# EAGLE board Flightcontroller (EAGLE 9.3.2)
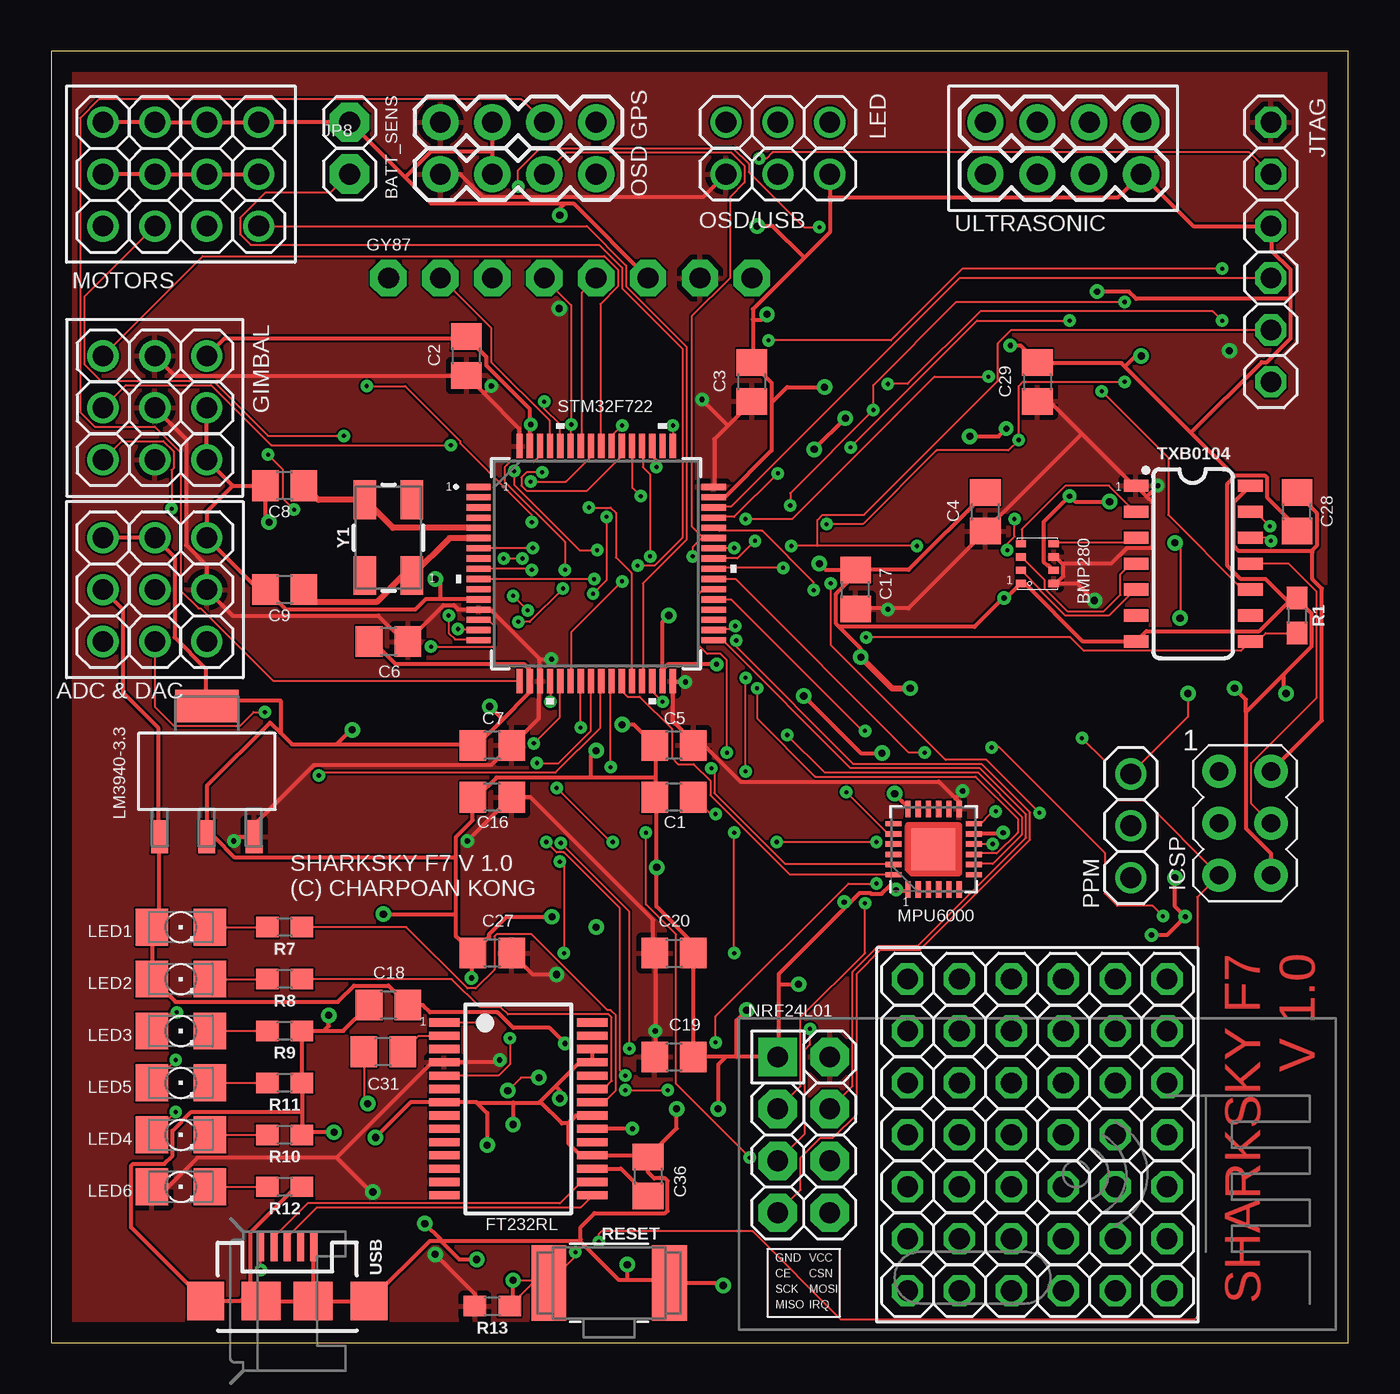
[diagram p10: board, top side]
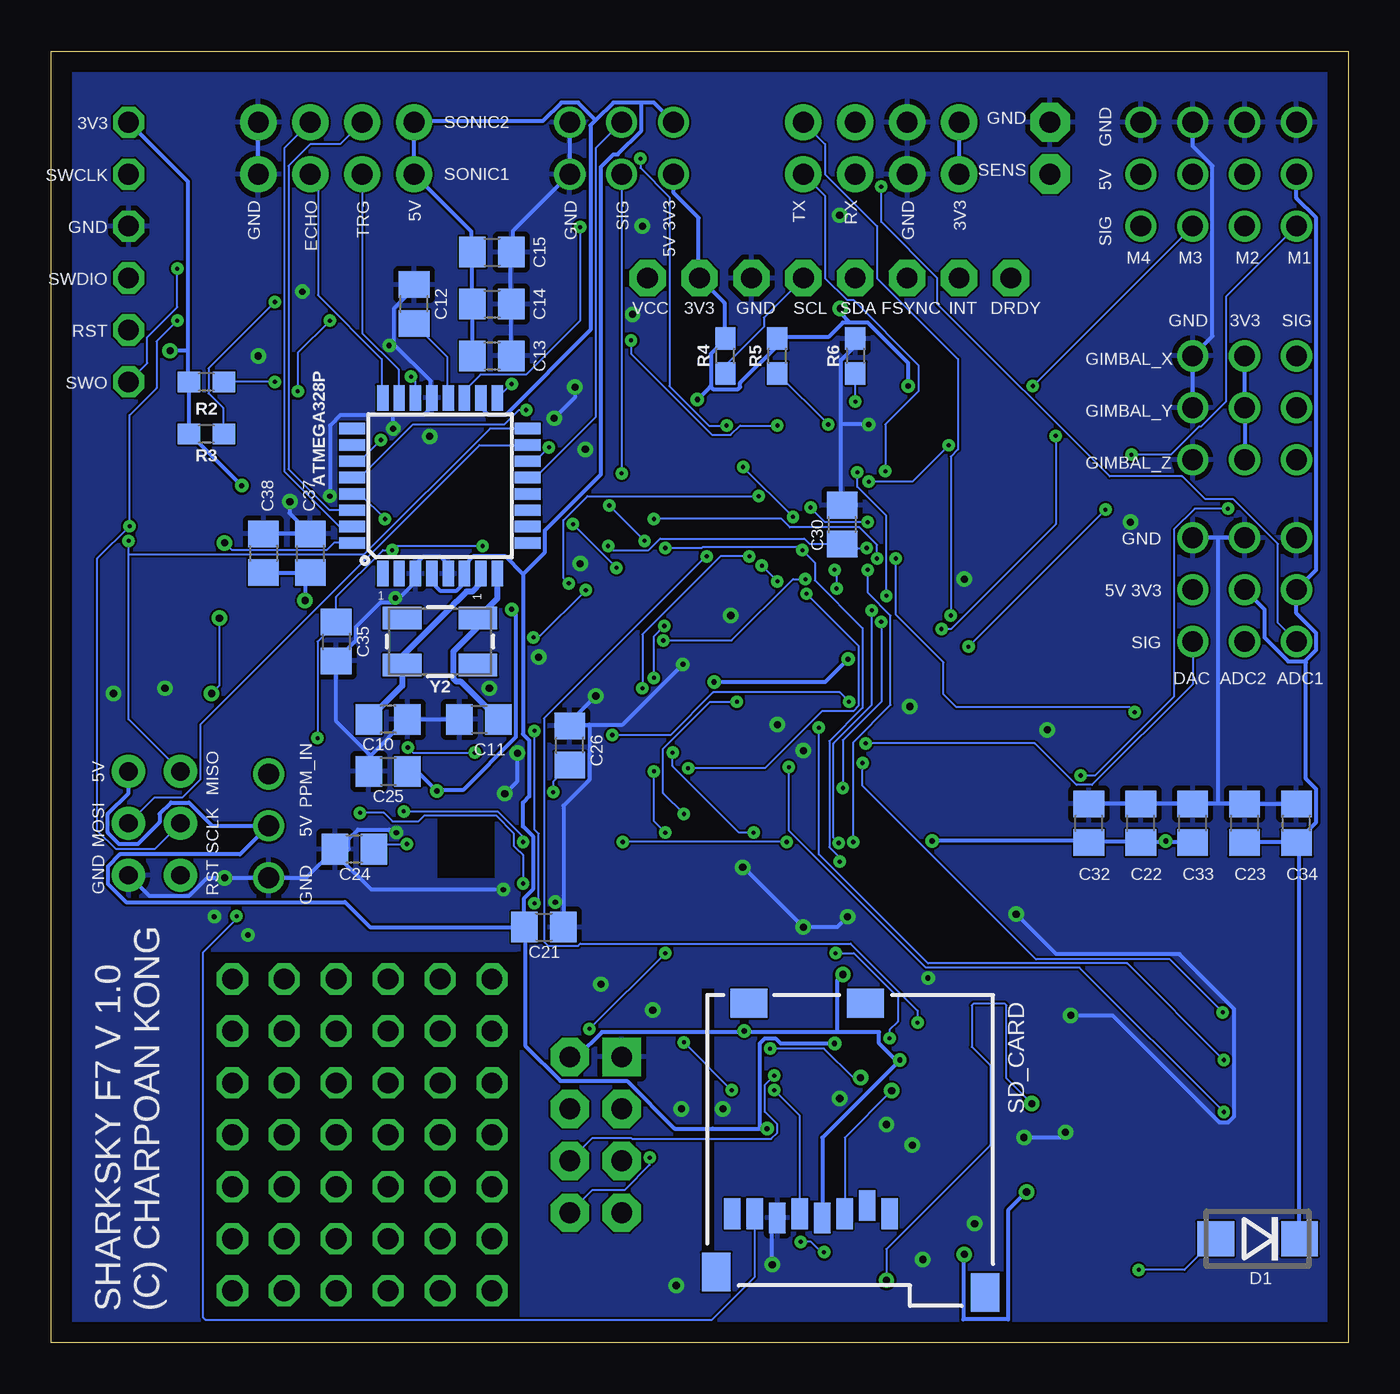
[diagram p11: board, bottom side, seen from below]

Size 63.48 x 63.17 mm. Coordinates in mm from the lower left corner, seen from the top.
Outline: 0,0 63.48,0 63.48,63.17 0,63.17 0,0
Copper layers (1*16): Top 0.035mm / dielectric 0.62mm / Bottom 0.035mm
Design rules "default *": minimum track width 4mil, minimum drill 8mil, track to track 4mil, track to pad 4mil, pad to pad 4mil, via to via 4mil, smd to smd 4mil, copper to edge 40mil, drill to drill 6mil, minimum pad ring 10mil, minimum via ring 8mil, stop-mask expansion 4mil, vias tented up to drill 14mil, thermal gap 10mil
Net classes: 0 default: width 0.102 mm, drill 0.102 mm, clearance 0.102 mm; 1 Supply: width 0.203 mm, drill 0.254 mm, clearance 0.102 mm
tKeepout: area 40.6,1.3 to 55.9,19.1; area 57.1,1.8 to 62,19.1; area 41.8,22.7 to 44.6,25.5
bKeepout: area 40.6,1.3 to 55.9,19.1; area 41.8,22.7 to 44.6,25.5
tRestrict: area 40.6,1.3 to 55.9,19.1; area 41.8,22.7 to 44.6,25.5
bRestrict: area 40.6,1.3 to 55.9,19.1; area 41.8,22.7 to 44.6,25.5

## Footprints (pad centres in the part's own frame; a part is rotated, then mirrored left to right if it is on the bottom)
1X03 = drill 1.016: 1 -2.54,0; 2 0,0; 3 2.54,0
TQFP32-08 = smd 1.27 x 0.559: 1 -4.293,2.8; 2 -4.293,2; 3 -4.293,1.2; 4 -4.293,0.4; 5 -4.293,-0.4; 6 -4.293,-1.2; 7 -4.293,-2; 8 -4.293,-2.8; 17 4.293,-2.8; 18 4.293,-2; 19 4.293,-1.2; 20 4.293,-0.4; 21 4.293,0.4; 22 4.293,1.2; 23 4.293,2; 24 4.293,2.8 | smd 0.559 x 1.27: 9 -2.8,-4.293; 10 -2,-4.293; 11 -1.2,-4.293; 12 -0.4,-4.293; 13 0.4,-4.293; 14 1.2,-4.293; 15 2,-4.293; 16 2.8,-4.293; 25 2.8,4.293; 26 2,4.293; 27 1.2,4.293; 28 0.4,4.293; 29 -0.4,4.293; 30 -1.2,4.293; 31 -2,4.293; 32 -2.8,4.293
1X01 = drill 1.016 pad 1.93 octagon: 1 0,0
BMP280 = smd 0.35 x 0.5: 1 0.975,-0.8; 2 0.325,-0.8; 3 -0.325,-0.8; 4 -0.975,-0.8; 5 -0.975,0.8; 6 -0.325,0.8; 7 0.325,0.8; 8 0.975,0.8
C0805 = smd 1.3 x 1.5: 1 -0.95,0; 2 0.95,0
DO214BA = smd 1.8 x 1.7: A 2.05,0; C -2.05,0
SSOP28 = smd 0.4 x 1.5: 1 -4.225,-3.625; 2 -3.575,-3.625; 3 -2.925,-3.625; 4 -2.275,-3.625; 5 -1.625,-3.625; 6 -0.975,-3.625; 7 -0.325,-3.625; 8 0.325,-3.625; 9 0.975,-3.625; 10 1.625,-3.625; 11 2.275,-3.625; 12 2.925,-3.625; 13 3.575,-3.625; 14 4.225,-3.625; 15 4.225,3.625; 16 3.575,3.625; 17 2.925,3.625; 18 2.275,3.625; 19 1.625,3.625; 20 0.975,3.625; 21 0.325,3.625; 22 -0.325,3.625; 23 -0.975,3.625; 24 -1.625,3.625; 25 -2.275,3.625; 26 -2.925,3.625; 27 -3.575,3.625; 28 -4.225,3.625
1X04-BIG = drill 1.016 pad 1.778: 1 0,0; 2 2.54,0; 3 5.08,0; 4 7.62,0
1X08-CLEANBIG = drill 1.016 pad 1.778 octagon: 1 -8.89,0; 2 -6.35,0; 3 -3.81,0; 4 -1.27,0; 5 1.27,0; 6 3.81,0; 7 6.35,0; 8 8.89,0
AVRISP = drill 0.9 pad 1.626: 1 -1.27,2.54; 2 1.27,2.54; 3 -1.27,0; 4 1.27,0; 5 -1.27,-2.54; 6 1.27,-2.54
1X06 = drill 1.016 octagon: 1 -6.35,0; 2 -3.81,0; 3 -1.27,0; 4 1.27,0; 5 3.81,0; 6 6.35,0
1206 = smd 1.6 x 1.803: A -1.422,0; C 1.422,0
SOT230P696X180-4N = smd 1.6 x 0.838: 1 -3.2,2.311; 2 -3.2,0; 3 -3.2,-2.311 | smd 1.6 x 3.099: 4 3.2,0
QFN50P400X400X95-25T265X275N = smd 0.26 x 0.79: 1 -1.25,-1.97; 2 -0.75,-1.97; 3 -0.25,-1.97; 4 0.25,-1.97; 5 0.75,-1.97; 6 1.25,-1.97; 13 1.25,1.97; 14 0.75,1.97; 15 0.25,1.97; 16 -0.25,1.97; 17 -0.75,1.97; 18 -1.25,1.97 | smd 0.79 x 0.26: 7 1.97,-1.25; 8 1.97,-0.75; 9 1.97,-0.25; 10 1.97,0.25; 11 1.97,0.75; 12 1.97,1.25; 19 -1.97,1.25; 20 -1.97,0.75; 21 -1.97,0.25; 22 -1.97,-0.25; 23 -1.97,-0.75; 24 -1.97,-1.25 | smd 2.15 x 2.05: 25 0,0
NRF24L01+ = drill 1.016 pad 1.88 octagon: CE -11.43,1.27; CSN -8.89,1.27; IRQ -8.89,-3.81; MISO -11.43,-3.81; MOSI -8.89,-1.27; SCK -11.43,-1.27; VCC -8.89,3.81 | drill 1.016 pad 1.88 square: GND -11.43,3.81
0603 = smd 1.1 x 1: 1 -0.85,0; 2 0.85,0
BTN_CK_KSS = smd 1.7 x 3.7: P$1 -2.95,0; P$2 2.95,0
3M_2908-05WB-MG = smd 0.8 x 1.5: 1 -1.94,3.1; 2 -0.84,2.7; 3 0.26,3.1; 4 1.36,3.3; 5 2.46,3.1; 6 3.56,3.3; 7 4.66,3.1; 8 5.76,3.1 | smd 1.4 x 1.9: P$1 6.55,5.95; P$2 -6.6,6.95 | smd 1.8 x 1.4: P$3 4.95,-7.2; P$4 -0.75,-7.2
LQFP64-10X10MM = smd 1.194 x 0.305: 1 -5.75,3.75; 2 -5.75,3.25; 3 -5.75,2.75; 4 -5.75,2.25; 5 -5.75,1.75; 6 -5.75,1.25; 7 -5.75,0.75; 8 -5.75,0.25; 9 -5.75,-0.25; 10 -5.75,-0.75; 11 -5.75,-1.25; 12 -5.75,-1.75; 13 -5.75,-2.25; 14 -5.75,-2.75; 15 -5.75,-3.25; 16 -5.75,-3.75; 33 5.75,-3.75; 34 5.75,-3.25; 35 5.75,-2.75; 36 5.75,-2.25; 37 5.75,-1.75; 38 5.75,-1.25; 39 5.75,-0.75; 40 5.75,-0.25; 41 5.75,0.25; 42 5.75,0.75; 43 5.75,1.25; 44 5.75,1.75; 45 5.75,2.25; 46 5.75,2.75; 47 5.75,3.25; 48 5.75,3.75 | smd 0.305 x 1.194: 17 -3.75,-5.75; 18 -3.25,-5.75; 19 -2.75,-5.75; 20 -2.25,-5.75; 21 -1.75,-5.75; 22 -1.25,-5.75; 23 -0.75,-5.75; 24 -0.25,-5.75; 25 0.25,-5.75; 26 0.75,-5.75; 27 1.25,-5.75; 28 1.75,-5.75; 29 2.25,-5.75; 30 2.75,-5.75; 31 3.25,-5.75; 32 3.75,-5.75; 49 3.75,5.75; 50 3.25,5.75; 51 2.75,5.75; 52 2.25,5.75; 53 1.75,5.75; 54 1.25,5.75; 55 0.75,5.75; 56 0.25,5.75; 57 -0.25,5.75; 58 -0.75,5.75; 59 -1.25,5.75; 60 -1.75,5.75; 61 -2.25,5.75; 62 -2.75,5.75; 63 -3.25,5.75; 64 -3.75,5.75
SO14 = smd 0.6 x 1.2: 1 -3.81,-2.8; 2 -2.54,-2.8; 3 -1.27,-2.8; 4 0,-2.8; 5 1.27,-2.8; 6 2.54,-2.8; 7 3.81,-2.8; 8 3.81,2.8; 9 2.54,2.8; 10 1.27,2.8; 11 0,2.8; 12 -1.27,2.8; 13 -2.54,2.8; 14 -3.81,2.8
USB-MICROB = smd 1.4 x 0.35: D+ -2.65,0; D- -2.65,-0.65; GND -2.65,1.3; ID -2.65,0.65; VBUS -2.65,-1.3 | smd 1.9 x 1.8: MT1 0,-4; MT2 0,4 | smd 1.9 x 1.9: P$1 0,-1.27; P$2 0,1.27
CRYSTAL-SMD-5X3.2-4PAD = smd 1.9 x 1.1: 1 -1.85,-1.15; 2 1.85,-1.15; 3 1.85,1.15; 4 -1.85,1.15

## Placement (x,y rotation side)
ADC1  [1X03]  2.54,36.83 90 top
ADC2  [1X03]  5.08,36.83 90 top
ATMEGA328P  ATMEGA328P_TQFP  [TQFP32-08]  44.45,41.91 90 bottom
BATT_SENS  [1X01]  14.61,59.69 0 top
BMP280  BMP280  [BMP280]  48.26,38.1 270 top
C1  4.7uF  [C0805]  30.48,26.67 180 top
C2  4.7uF  [C0805]  20.32,48.26 90 top
C3  100nF  [C0805]  34.29,46.99 90 top
C4  100nF  [C0805]  45.72,40.64 90 top
C5  100nF  [C0805]  30.48,29.21 180 top
C6  100nF  [C0805]  16.51,34.29 180 top
C7  100nF  [C0805]  21.59,29.21 180 top
C8  10pF  [C0805]  11.43,41.91 180 top
C9  10pF  [C0805]  11.43,36.83 180 top
C10  10pF  [C0805]  46.99,30.48 180 bottom
C11  10pF  [C0805]  42.55,30.48 0 bottom
C12  100nF  [C0805]  45.72,50.8 90 bottom
C13  4.7uF  [C0805]  41.91,48.26 0 bottom
C14  1uF  [C0805]  41.91,50.8 0 bottom
C15  1uF  [C0805]  41.91,53.34 0 bottom
C16  1uF  [C0805]  21.59,26.67 180 top
C17  1uF  [C0805]  39.37,36.83 90 top
C18  100nF  [C0805]  16.51,16.51 180 top
C19  100nF  [C0805]  30.48,13.97 0 top
C20  4.7uF  [C0805]  30.48,19.05 0 top
C21  4.7uF  [C0805]  39.37,20.32 0 bottom
C22  10uF  [C0805]  10.16,25.4 90 bottom
C23  10uF  [C0805]  5.08,25.4 90 bottom
C24  100nF  [C0805]  48.64,24.13 180 bottom
C25  100nF  [C0805]  46.99,27.94 0 bottom
C26  2.2nF  [C0805]  38.1,29.21 90 bottom
C27  4.7uF  [C0805]  21.59,19.05 180 top
C28  100nF  [C0805]  60.96,40.64 90 top
C29  100nF  [C0805]  48.26,46.99 270 top
C30  100nF  [C0805]  24.77,40.01 90 bottom
C31  100nF  [C0805]  16.26,14.22 180 top
C32  10uF  [C0805]  12.7,25.4 90 bottom
C33  10uF  [C0805]  7.62,25.4 90 bottom
C34  1uF  [C0805]  2.54,25.4 90 bottom
C35  100nF  [C0805]  49.53,34.29 270 bottom
C36  100nF  [C0805]  29.21,8.13 270 top
C37  100nF  [C0805]  50.8,38.61 270 bottom
C38  100nF  [C0805]  53.09,38.61 270 bottom
D1  [DO214BA]  4.44,5.08 180 bottom
DAC  [1X03]  7.62,36.83 90 top
FT232RL  FT232RL  [SSOP28]  22.86,11.43 270 top
GIMBAL_X  [1X03]  5.08,48.26 0 top
GIMBAL_Y  [1X03]  5.08,45.72 0 top
GIMBAL_Z  [1X03]  5.08,43.18 0 top
GPS  1X4-BIG  [1X04-BIG]  19.05,59.69 0 top
GY87  [1X08-CLEANBIG]  25.4,52.07 0 top
ICSP  AVRISP-6  [AVRISP]  58.42,25.4 0 top
JP1  [1X06]  48.26,17.78 0 top
JP2  [1X06]  48.26,15.24 0 top
JP3  [1X06]  48.26,12.7 0 top
JP4  [1X06]  48.26,10.16 0 top
JP5  [1X06]  48.26,7.62 0 top
JP6  [1X06]  48.26,5.08 0 top
JP7  [1X06]  48.26,2.54 0 top
JP8  [1X01]  14.61,57.15 0 top
JTAG  [1X06]  59.69,53.34 270 top
LED  [1X03]  35.56,59.69 0 top
LED1  [1206]  6.35,20.32 0 top
LED2  [1206]  6.35,17.78 0 top
LED3  [1206]  6.35,15.24 0 top
LED4  [1206]  6.35,10.16 0 top
LED5  [1206]  6.35,12.7 0 top
LED6  [1206]  6.35,7.62 0 top
LM3940-3.3  LM3940IMPX-3.3/NOPB  [SOT230P696X180-4N]  7.62,27.94 90 top
M1  [1X03]  2.54,57.15 90 top
M2  [1X03]  5.08,57.15 90 top
M3  [1X03]  7.62,57.15 90 top
M4  [1X03]  10.16,57.15 90 top
MPU6000  MPU6000  [QFN50P400X400X95-25T265X275N]  43.18,24.13 0 top
NRF24L01  NRF24L01+  [NRF24L01+]  46.99,10.16 0 top
OSD  1X4-BIG  [1X04-BIG]  19.05,57.15 0 top
OSD/USB  [1X03]  35.56,57.15 0 top
PPM  [1X03]  52.83,25.27 270 top
R1  10k  [0603]  60.96,35.56 270 top
R2  4.7k  [0603]  55.88,46.99 180 bottom
R3  4.7k  [0603]  55.88,44.45 180 bottom
R4  4.7k  [0603]  30.48,48.26 90 bottom
R5  4.7k  [0603]  27.94,48.26 90 bottom
R6  10k  [0603]  24.13,48.26 270 bottom
R7  1k  [0603]  11.43,20.32 180 top
R8  1k  [0603]  11.43,17.78 180 top
R9  1k  [0603]  11.43,15.24 180 top
R10  1k  [0603]  11.43,10.16 180 top
R11  1k  [0603]  11.43,12.7 180 top
R12  1k  [0603]  11.43,7.62 180 top
R13  10k  [0603]  21.59,1.78 180 top
RESET  [BTN_CK_KSS]  27.3,2.92 0 top
SD_CARD  2908-05WB-MG  [3M_2908-05WB-MG]  24.38,9.4 180 bottom
SONIC1  1X4-BIG  [1X04-BIG]  45.72,59.69 0 top
SONIC2  1X4-BIG  [1X04-BIG]  45.72,57.15 0 top
STM32F722  STM32F7X2RXT  [LQFP64-10X10MM]  26.67,38.1 0 top
TXB0104  TXB0104  [SO14]  55.88,38.1 270 top
USB  [USB-MICROB]  11.56,2.03 270 top
Y1  8MHz  [CRYSTAL-SMD-5X3.2-4PAD]  16.51,39.37 90 top
Y2  16MHz  [CRYSTAL-SMD-5X3.2-4PAD]  44.45,34.29 180 bottom

## Tracks (layer width: path | path; a pad name or v marks a point on that pad's centre or on a via)
A_SPI_MISO  (via drill 0.2)
  Top 0.102: TXB0104.12 59.54,39.37 v59.69,39.22
  Bottom 0.102: 59.69,38.53 59.69,30.48 ICSP.1 | 59.69,38.53 v59.69,39.22 | 59.69,38.53 48.18,38.53 42.01,44.7 40.18,44.7 ATMEGA328P.16
A_SPI_MOSI
  Top 0.102: TXB0104.11 60.55,38.1 61.93,36.73 61.93,31.55 58.73,28.35 58.73,26.37 ICSP.4
  Bottom 0.102: ICSP.4 58.42,26.67 57.05,26.67 56.19,27.53 56.19,30.23 42.52,43.89 40.18,43.89 ATMEGA328P.15
A_SPI_NSS  (via drill 0.2)
  Top 0.102: TXB0104.10 58.32,36.83 54.66,40.49 54.66,43.28 v51.41,46.53 | v49.84,49.99 45.31,49.99 v39.12,43.79
  Bottom 0.102: v51.41,46.53 51.41,48.41 v49.84,49.99 | v39.12,43.79 39.78,43.13 40.13,43.13 ATMEGA328P.14
A_SPI_SCLK  (via drill 0.2)
  Top 0.102: TXB0104.13 58.93,40.64 v59.64,39.93 | v40.95,46.89 41.91,46.89 45.47,50.44 56.84,50.44 v57.3,49.99
  Bottom 0.102: ICSP.3 58.42,24.13 60.3,24.13 61.21,25.04 61.21,38.35 v59.64,39.93 59.64,45.36 58.32,46.69 58.32,48.97 v57.3,49.99 | v40.95,46.89 41.61,46.23 ATMEGA328P.17
ADC1  (via drill 0.2)
  Top 0.102: v37.59,54.56 36.83,54.56 34.14,57.25 34.14,57.66 33.38,58.42 23.93,58.42 22.86,57.35 v22.86,56.54
  Bottom 0.102: v37.59,54.56 37.59,49.99 40.23,47.35 42.47,47.35 43.23,46.58 43.23,46.23 ATMEGA328P.19 | v22.86,56.54 22.86,54.81 20.12,52.07 20.12,50.8 11.68,42.37 8.13,42.37 7.01,41.25 5.64,41.25 3.45,39.07 3.45,35.2 ADC1.1
ADC2  (via drill 0.2)
  Top 0.102: v45.87,47.24 43.23,47.24 36.27,40.28 v33.98,40.28 | v22.15,38.35 v23.06,38.35 | v10.46,30.84 9.91,30.84 9.25,30.18 5.99,30.18 5.08,31.09 ADC2.1
  Bottom 0.102: v45.87,47.24 45.67,47.04 45.67,46.23 ATMEGA328P.22 | v33.98,40.28 27.74,40.28 27.33,39.88 23.93,39.88 23.06,39.01 v23.06,38.35 | v22.15,38.35 22.15,35.61 19.81,33.27 19.81,31.7 19.2,31.09 10.72,31.09 v10.46,30.84
B_SPI_MISO
  Top 0.102: BMP280.5 49.07,39.12 52.78,39.12 53.04,39.37 TXB0104.3
B_SPI_MOSI
  Top 0.102: BMP280.3 47.5,38.41 48.62,37.29 48.62,36.88 49.73,35.76 51.51,35.76 52.32,36.58 52.32,37.59 52.83,38.1 TXB0104.4
B_SPI_NSS
  Top 0.102: BMP280.2 47.5,37.74 48.41,36.83 48.41,36.78 49.63,35.56 51.77,35.56 53.04,36.83 TXB0104.5
B_SPI_SCLK
  Top 0.102: BMP280.4 47.5,39.12 47.5,39.78 49.63,41.91 51.77,41.91 53.04,40.64 TXB0104.2
BATTSENS  (via drill 0.2)
  Top 0.102: v27.94,37.24 25.45,34.75 25.45,32.36 STM32F722.22 | v28.7,38 29.52,38 30.89,39.37 30.89,48.62 27.94,51.56 27.94,52.58 26.82,53.7 9.75,53.7 9.25,54.2 9.25,55.02 10.46,56.24 13.66,56.24 14.58,57.15 JP8.1
  Bottom 0.102: v28.7,38 v27.94,37.24
CE  (via drill 0.2)
  Top 0.102: v39.83,29.92 39.7,29.92 33.3,36.32 32.46,36.32 STM32F722.37 | v39.83,21.49 39.83,19.05 36.68,15.9 36.68,12.55 NRF24L01.CE
  Bottom 0.102: v39.83,29.92 39.83,25.1 39.62,24.89 39.62,21.69 v39.83,21.49
DAC_OUT  (via drill 0.2)
  Top 0.102: v23.62,29.31 24.89,30.58 24.89,32.31 STM32F722.21
  Bottom 0.102: v23.62,29.31 15.34,29.31 13.31,27.28 12.55,27.28 7.62,32.21 DAC.1
ECHO1_IN
  Bottom 0.102: SONIC1.3 52.07,58.42 52.07,42.62 49.38,39.93 48.77,39.93 ATMEGA328P.31
ECHO2_IN
  Bottom 0.102: SONIC2.3 50.42,56.77 50.42,51.23 47.3,48.11 47.3,46.23 ATMEGA328P.24
GIMBAL_X
  Top 0.102: GIMBAL_X.1 7.42,53.14 27.08,53.14 27.74,52.48 27.74,51.66 26.87,50.8 26.87,43.89 STM32F722.56
GIMBAL_Y  (via drill 0.2)
  Top 0.102: v23.47,42.11 25.2,42.11 26.42,43.33 STM32F722.57 | v19.56,43.89 10.77,43.89 7.82,46.84 3.66,46.84 GIMBAL_Y.1
  Bottom 0.102: v23.47,42.11 21.34,42.11 v19.56,43.89
GIMBAL_Z  (via drill 0.2)
  Top 0.102: v13.11,27.74 13.26,27.89 24.69,27.89 26.87,30.07 26.87,32.31 STM32F722.25 | v5.89,40.79 5.89,42.67 5.99,42.77 5.99,43.59 5.49,44.09 3.45,44.09 GIMBAL_Z.1
  Bottom 0.102: v13.11,27.74 12.39,27.74 8.53,31.6 8.53,39.78 7.52,40.79 v5.89,40.79
GND  (via drill 0.25, 0.3, 0.3 pad 0.55, 0.35, 0.35 pad 0.55)
  Top 0.203: 35.26,45.97 35.26,46.94 34.29,47.9 C3.2 34.34,48.01 34.34,50.04 | 35.26,45.97 35.26,43.64 32.97,41.35 32.46,41.35 STM32F722.47 | 34.34,50.04 34.34,50.55 36.85,53.06 | 36.85,53.06 38.1,54.3 38.1,56.03 | OSD/USB.3 38.1,56.03 | BMP280.7 49.02,37.8 48.82,38 48.77,38 48.57,38.2 48.57,40.13 v49.84,41.4 50.11,41.13 v51.8,41.13 | C17.2 39.37,37.8 41.96,37.8 45.72,41.55 C4.2 | R1.1 60.96,36.37 60.71,36.37 59.13,34.8 53.59,34.8 53.14,34.34 TXB0104.7 50.5,34.29 47.7,37.08 47.5,37.08 BMP280.1 47.4,37.08 46.69,36.37 v46.63,36.42 46.61,36.42 45.19,35 38.56,35 | C28.1 60.96,39.88 59.49,41.35 59.49,42.32 59.38,42.42 57.96,42.42 57.91,42.37 | 57.91,42.37 57.56,42.01 57.56,38 58.22,37.34 59.44,37.34 60.5,36.27 R1.1 | 57.91,42.37 55.78,44.5 | 55.78,44.5 52.55,47.73 | 52.55,47.73 52.38,47.9 48.26,47.9 C29.1 48.21,48.01 47.45,48.77 v46.94,48.77 | 38.56,35 38.41,35.15 38.41,36.63 39.32,37.54 39.32,37.69 C17.2 | ICSP.6 59.69,23.93 58.47,25.15 58.47,30.84 | 60.3,32.66 61.67,34.04 61.67,35.66 61.01,36.32 R1.1 | 60.3,32.66 58.47,30.84 | 60.66,51.05 60.66,49.12 59.49,47.96 59.23,47.96 55.78,44.5 | 60.66,51.05 60.66,52.48 59.74,53.39 59.74,54.56 JTAG.3 55.88,54.61 SONIC2.4 52.22,56.03 38.1,56.03 | M1.3 M2.3 M3.3 M4.3 BATT_SENS.1 14.63,59.69 17.32,57 | GPS.2 21.59,58.27 | 21.59,58.27 OSD.2 | GY87.6 25.55,55.73 25.15,55.73 | 25.15,55.73 18.59,55.73 17.32,57 | 21.59,58.27 18.59,58.27 17.32,57 | 22.03,30.42 20.83,29.21 C7.2 20.57,29.26 13.97,29.26 | 22.03,30.42 23.42,31.8 23.42,32.31 STM32F722.18 23.37,32.41 23.37,32.97 23.16,33.17 16.87,33.17 15.75,34.29 C6.2 | 11.23,29.82 11.23,31.39 7.87,31.39 LM3940-3.3.4 7.57,31.19 7.57,32.97 6.04,34.49 6.04,38.41 ADC2.3 ADC1.3
  Top 0.203: 19.05,36.37 18.34,36.37 17.83,35.87 11.48,35.87 10.52,36.83 C9.2 10.41,36.88 10.11,36.88 DAC.3 7.62,40.64 8.89,41.91 | 19.05,36.37 20.88,36.37 STM32F722.12 | 23.42,44.91 23.42,45.67 21.29,47.8 21.29,48.21 20.32,49.17 C2.2 20.27,49.12 8.48,49.12 GIMBAL_X.3 | 23.42,44.91 23.42,43.89 STM32F722.63 | 8.89,41.91 C8.2 10.48,40.32 v10.67,40.13 | 8.89,41.91 GIMBAL_Z.3 GIMBAL_Y.3 | v23.47,44.91 23.42,44.91 | 13.97,29.26 11.79,29.26 11.23,29.82 | 11.23,29.82 10.72,30.33 7.62,27.23 LM3940-3.3.2 7.67,24.69 8.03,24.69 8.99,23.72 19.81,23.72 | USB.GND 12.85,2.03 USB.P$2 | USB.P$2 USB.MT2 15.65,2.08 18.54,4.98 19.05,4.98 | 12.29,11.28 12.29,12.7 R11.1 12.29,12.75 12.29,15.24 R9.1 13.34,15.24 | 12.29,11.28 12.29,10.29 | 12.29,10.29 12.29,10.16 R10.1 | R12.1 11.99,7.62 9.75,5.39 9.75,2.54 10.26,2.03 USB.P$1 | USB.P$1 9.7,2.49 9.25,2.03 USB.MT1 7.47,2.08 3.91,5.64 3.91,8.64 4.01,8.74 5.54,8.74 5.94,9.14 5.94,10.36 6.86,11.28 12.29,11.28 | USB.P$1 USB.P$2 | 28.19,3.07 27.76,3.07 25.86,4.98 | 28.19,3.07 30.08,3.07 RESET.P$2 32.77,2.92 v32.89,2.79 | 19.05,4.98 25.86,4.98 | v32.56,33.17 30.17,33.17 29.92,32.92 STM32F722.31 29.92,35.25 v30.23,35.56 | v20.57,17.83 20.57,19 20.62,19.05 C27.2 | 19.81,20.96 19.81,19.86 20.57,19.1 C27.2 | 19.81,20.96 19.81,23.72 | 19.81,23.72 19.81,24.74 20.62,25.55 20.62,26.67 C16.2 20.73,26.72 20.88,26.72 21.79,27.63 26.42,27.63 | 29.57,27.63 29.57,29.21 C5.2 28.51,30.23 v27.94,30.23 | 29.57,27.63 29.57,26.67 C1.2 29.62,26.62 29.62,21.34 31.34,19.61 31.34,19.1 C20.2 31.45,19.05 31.45,14.02 C19.2 33.02,13.97 | 33.53,13.97 NRF24L01.GND 35.61,14.02 35.61,17.53
  Top 0.203: 33.53,13.97 33.02,13.97 | 38.96,21.39 35.61,18.03 35.61,17.53 | 38.96,21.39 39.57,22 40.08,22 40.13,21.95 40.64,21.95 41.1,22.4 v41.35,22.15 41.35,22.1 41.86,22.1 MPU6000.1 | 29.57,27.63 26.42,27.63 | 38.96,21.39 v38.81,21.54 | 20.83,11.73 22.61,11.73 | 22.61,11.73 23.88,11.73 | 23.88,11.73 23.98,11.73 24.99,10.72 25.3,10.72 | 25.3,10.72 25.3,9.75 25.9,9.16 FT232RL.18 29.13,9.16 C36.1 | 20.83,11.73 21.34,11.23 v21.34,9.65 | 23.88,11.73 24.68,12.54 | 24.68,12.54 25.85,13.71 FT232RL.25 FT232RL.26 | 20.83,11.73 20.81,11.76 FT232RL.7 17.6,11.76 v15.88,10.03 | 25.3,10.72 25.69,11.11 FT232RL.21 | 13.34,15.24 14.29,15.24 C18.2 | 19.05,4.98 19.96,4.06 v20.83,4.06 | 19.05,4.98 19.05,5.06 v18.29,5.82 | C36.1 29.21,8.33 29.51,8.03 30.04,8.03 30.16,7.91 30.16,6.44 30.04,6.33 26.59,6.33 25.91,5.65 25.91,5.03 25.86,4.98 | 33.53,13.97 33.53,15.75 v34.04,16.26 | 35.61,17.53 v36.58,17.53 | 19.05,36.37 19.05,37.08 v18.8,37.34 | 13.97,29.26 14.68,29.97 v14.73,29.97 | C17.2 37.91,37.78 v37.59,38.1 | 58.47,30.84 58.47,31.45 v57.91,32 | 60.3,32.66 60.3,31.88 v60.43,31.75 | 52.55,47.73 53.09,48.26 v53.34,48.26 | 25.15,55.73 24.89,55.47 v24.89,55.14 | 36.85,53.06 35.31,54.61 v34.54,54.61 | 34.34,50.04 34.77,50.04 v35.03,50.29 | 35.26,45.97 36.02,46.74 v37.85,46.74 | v38.86,45.21 v37.34,43.69 | 26.42,27.63 26.42,28.7 v26.67,28.96 | 60.66,51.05 53.09,51.05 52.74,51.41 v51.18,51.41 | 22.03,30.42 22.03,30.54 v21.46,31.12 | v39.62,33.53 39.62,33.93 38.56,35 | v36.83,31.62 39.62,28.83 v40.66,28.83 | v46.58,24.94 46.53,24.89 45.16,24.89 MPU6000.11 | MPU6000.18 41.93,26.2 v41.27,26.85 | v44.96,44.32 46.36,44.32 v46.74,44.7
  Top 0.203: v53.85,19.94 54.61,19.94 v55.5,20.83 54.99,21.34 v54.99,22.73 | 28.19,3.07 v28.19,3.81 | 24.68,12.54 24.89,12.32 v24.89,11.94 | C36.1 30.61,10.48 v30.61,11.43 | 33.02,13.97 32.64,13.59 v32.64,11.43 | C27.2 21.44,19.85 21.44,19.97 22.3,20.83 v24.51,20.83 | v13.84,10.29 12.29,10.29 | 13.34,15.24 13.59,15.49 v13.59,16 | v16.26,20.96 19.81,20.96 | 22.61,11.73 v22.61,10.67
  Top 0.305: v39.62,33.53 41.15,32 v42.04,32
  Bottom 0.203: C13.2 41,48.26 41,50.8 C14.2 41,50.85 41,53.34 C15.2 40.89,53.39 40.89,54.36 OSD/USB.3 LED.3 | v49.84,41.4 49.84,44.86 49.33,45.36 46.74,45.36 | 46.74,45.36 45.26,45.36 44.86,45.77 44.86,46.18 ATMEGA328P.21 44.91,46.28 44.91,47.04 46.69,48.82 | C12.2 45.72,51.56 46.69,50.6 46.69,48.82 | SONIC2.4 SONIC1.4 | ATMEGA328P.5 44.09,37.64 44.09,38.1 44.45,38.46 45.26,38.46 45.62,38.1 45.62,37.64 ATMEGA328P.3 45.67,37.54 45.67,37.19 46.53,36.32 | C11.1 C10.1 46.13,30.43 47.85,28.7 | 47.85,28.7 47.9,28.65 47.9,27.94 C25.1 | 47.85,28.7 49.53,30.38 C35.2 49.48,33.43 48.57,34.34 48.57,35 47.35,36.22 46.63,36.22 46.53,36.32 | v46.63,36.42 46.53,36.32 | v46.94,48.77 46.74,48.77 46.69,48.82 | C34.2 2.54,26.37 5.08,26.37 C23.2 5.13,26.37 6.4,26.37 | 6.4,26.37 7.62,26.37 C33.2 7.67,26.37 10.16,26.37 C22.2 10.21,26.37 12.7,26.37 C32.2 | ADC2.3 6.4,39.37 | 6.4,39.37 DAC.3 | R6.1 24.13,48.77 24.84,48.06 24.84,44.91 | 24.84,44.91 24.84,41.05 24.79,41 C30.2 | GIMBAL_Y.3 GIMBAL_X.3 6.65,49.23 6.65,57.56 7.62,58.52 M3.3 | v23.47,44.91 24.84,44.91 | 6.4,39.37 6.4,26.37 | v32.56,33.17 35.51,30.23 37.13,30.23 | 37.13,30.23 38.05,30.23 38.1,30.18 C26.2 38.1,30.35 v36.83,31.62 | 38.41,21.54 38.41,26.26 37.13,27.53 37.13,30.23 | 38.41,21.54 38.41,20.32 C21.2 | v38.81,21.54 38.41,21.54 | 48.97,24.08 49.51,24.08 C24.2 50.99,22.73 PPM.3 v54.99,22.73 55.84,22.73 56.73,21.84 58.67,21.84 ICSP.6 | v41.35,22.15 47.8,22.15 49.35,23.7 48.97,24.08 | v51.8,41.13 51.82,41.15 51.82,40.57 C37.1 C38.1 | v37.85,46.74 37.85,46.23 v38.86,45.21 | v46.58,24.94 46.79,24.94 46.94,25.1 48.46,25.1 48.92,24.64 48.92,24.13 48.97,24.08
  Bottom 0.203: v41.27,26.85 40.66,27.46 v40.66,28.83 | v28.19,3.81 28.19,5.85 SD_CARD.6 | v46.74,44.7 46.74,45.36 | v24.51,20.83 25.02,20.32 v26.67,20.32 29.59,23.24 v29.64,23.24 | v15.88,10.03 14.1,10.03 v13.84,10.29 | v13.59,16 11.54,16 6.31,10.77 5.89,10.77 5.59,11.07 5.59,16.31 8.27,19 14.3,19 v16.26,20.96
  pour Bottom: 0.25,62.99 0.25,0 63.5,0 63.75,0.25 63.75,62.99
I2C1_SCL
  Top 0.102: GY87.5 25.96,51.36 25.96,43.89 STM32F722.58
  Bottom 0.102: R4.1 30.48,47.8 28.6,49.68 28.6,50.14 GY87.5
I2C1_SDA  (via drill 0.2)
  Top 0.102: STM32F722.59 25.45,43.89 v25.45,44.91 25.45,50.75 GY87.4
  Bottom 0.102: v25.45,44.91 27.94,47.4 R5.1
I2C2_SCL  (via drill 0.2)
  Top 0.102: v52.53,50.9 44.3,50.9 40.23,46.84 v40.23,45.62 36.17,41.55 v36.17,40.95 | v34.44,39.22 33.58,38.35 32.46,38.35 STM32F722.41
  Bottom 0.102: v52.53,50.9 55.78,47.65 55.78,46.43 55.07,45.72 55.07,44.45 R3.1 | v40.23,45.62 40.59,45.62 41.3,44.91 45.77,44.91 48.36,42.32 48.72,42.32 ATMEGA328P.28 | v36.17,40.95 v34.44,39.22
I2C2_SDA  (via drill 0.2)
  Top 0.102: v52.53,46.99 47.55,46.99 47.35,46.79 v47.35,44.15 46.84,43.64 43.33,43.64 39.73,40.03 v37.95,40.03 | v35.81,37.9 32.46,37.9 STM32F722.40
  Bottom 0.102: v52.53,46.99 R2.1 | v47.35,44.15 48.36,43.13 48.72,43.13 ATMEGA328P.27 | v37.95,40.03 v35.81,37.9
IMU_INT  (via drill 0.2)
  Top 0.102: v46.23,25.98 46.1,25.86 45.97,25.86 45.47,25.35 45.18,25.35 MPU6000.12 | v35.51,24.49 v40.39,24.49 | v27.48,24.49 27.38,24.49 v24.74,27.13 | v22.86,35.26 23.42,35.26 v25.04,36.88 | v25.15,37.8 25.15,39.17 22.2,42.11 22.2,42.82 22.45,43.08 23.62,43.08 23.88,43.33 23.88,43.84 STM32F722.62
  Bottom 0.102: v46.23,25.98 41.63,25.98 40.39,24.74 v40.39,24.49 | v27.48,24.49 v35.51,24.49 | v24.74,27.13 24.74,29.46 22.86,31.34 v22.86,35.26 | v25.04,36.88 25.04,37.69 v25.15,37.8
INIT_OK  (via drill 0.2)
  Top 0.102: v25.91,30.07 25.91,32.31 STM32F722.23 | v6.1,13.82 4.98,12.7 LED5.A
  Bottom 0.102: v25.91,30.07 25.91,23.88 20.57,18.54 10.82,18.54 v6.1,13.82
INTA
  Top 0.102: GY87.2 19.1,52.07 21.54,49.63 21.54,47.96 24.38,45.11 24.38,43.89 STM32F722.61
IRQ  (via drill 0.2)
  Top 0.102: v33.07,28.85 33.07,33.38 32.77,33.68 32.11,33.68 31.65,34.14 31.65,36.58 31.9,36.83 32.41,36.83 STM32F722.38 | v29.11,24.94 29.11,21.44 30.58,19.96 30.58,12.65 v34.19,9.04
  Bottom 0.102: v33.07,28.85 33.07,28.19 29.82,24.94 v29.11,24.94 | v34.19,9.04 34.19,8.69 35.41,7.47 36.98,7.47 NRF24L01.IRQ
LED
  Bottom 0.102: LED.2 36.83,58.42 36.83,45.26 39.78,42.32 40.13,42.32 ATMEGA328P.13
LED_RX
  Top 0.102: R8.1 19.61,17.78 20.98,16.41 22,16.41 22.35,16.05 27.28,16.05 27.43,15.9 27.43,12.8 27.08,12.45 26.52,12.45 FT232RL.23
LED_TX
  Top 0.102: R7.1 17.37,20.32 20.37,17.32 20.78,17.32 21.69,18.24 21.69,19.86 21.79,19.96 23.52,19.96 27.23,16.26 27.38,16.26 27.63,16 27.63,12.34 27.08,11.79 26.52,11.79 FT232RL.22
LLVOE  (via drill 0.2)
  Top 0.102: R1.2 60.96,34.7 59.44,34.7 59.03,34.29 TXB0104.8 58.22,33.83 50.55,33.83 49.89,34.49 v39.88,34.49 | v37.31,36.8 37.31,37.19 34.8,39.7 32.69,39.7 STM32F722.44
  Bottom 0.102: v39.88,34.49 39.62,34.49 v37.31,36.8
MOD0_LED  (via drill 0.2)
  Top 0.102: v23.77,28.35 24.84,28.35 26.42,29.92 26.42,32.31 STM32F722.24 | v6.15,16.15 5.89,16.15 4.98,15.24 LED3.A
  Bottom 0.102: v23.77,28.35 23.77,27.23 15.29,18.75 8.74,18.75 v6.15,16.15
MOD1_LED  (via drill 0.2)
  Top 0.102: v27.38,28.14 27.38,32.31 STM32F722.26 | v6.1,11.28 4.98,10.16 LED4.A
  Bottom 0.102: v27.38,28.14 27.38,25.04 20.68,18.34 13.16,18.34 v6.1,11.28
N$1  (via drill 0.2)
  Top 0.102: v29.92,31.34 29.46,31.8 29.46,32.31 STM32F722.30 | v32.51,25.86 32.26,25.86 31.45,26.67 C1.1
  Bottom 0.102: v29.92,31.34 31.24,31.34 33.53,29.06 33.53,26.87 v32.51,25.86
N$2
  Top 0.203: 15.46,41.12 Y1.3
  Top 0.305: STM32F722.5 16.73,39.85 15.46,41.12 | Y1.3 13.07,41.22 C8.1
N$3
  Top 0.305: STM32F722.6 19.49,39.35 Y1.1 17.22,37.52 15.92,36.22 12.32,36.22 12.38,36.28 C9.1
N$4
  Bottom 0.102: ATMEGA328P.20 44.09,46.23 44.09,48.21 45.72,49.84 C12.1
N$5  (via drill 0.2)
  Top 0.102: v46.08,24.38 MPU6000.10
  Bottom 0.102: v46.08,24.38 47.04,24.38 47.3,24.13 C24.1
N$6
  Bottom 0.305: ATMEGA328P.7 42.46,37.6 42.46,37.13 42.87,36.73 43.15,36.73 43.64,36.24 43.66,36.24 43.8,36.1 43.8,36.08 46.3,33.58 Y2.3 46.3,32.12 C10.2
N$7
  Bottom 0.305: ATMEGA328P.8 41.65,36.39 Y2.1 42.6,35 43.8,33.8 43.8,32.49 43.66,32.34 43.45,32.34 C11.2
N$8  (via drill 0.2)
  Top 0.102: v24.13,46.02 24.13,45.67 24.89,44.91 24.89,43.89 STM32F722.60
  Bottom 0.102: v24.13,46.02 R6.2
N$9
  Top 0.102: C31.1 17.99,15.01 FT232RL.2
N$10
  Top 0.203: FT232RL.17 27.88,8.51 C36.2
N$11  (via drill 0.2)
  Top 0.102: v38.91,26.92 40.95,24.89 41.2,24.89 MPU6000.20
  Bottom 0.102: v38.91,26.92 38.91,27.43 38.1,28.24 C26.1
N$13
  Top 0.102: LED1.C R7.2
N$14
  Top 0.102: LED2.C R8.2
N$15
  Top 0.102: LED3.C R9.2
N$16
  Top 0.102: LED4.C R10.2
N$17
  Top 0.102: LED5.C R11.2
N$18
  Top 0.102: LED6.C R12.2
PPM_IN  (via drill 0.35)
  Top 0.102: v54.99,39.12 55.25,38.86 v55.25,35.43 | v55.63,31.75 55.63,30.61 PPM.1
  Bottom 0.102: ATMEGA328P.32 49.63,39.11 49.99,38.76 54.63,38.76 v54.99,39.12 | v55.25,35.43 55.25,32.13 v55.63,31.75
PWM_1  (via drill 0.2)
  Top 0.102: v18.59,34.04 21.59,34.04 21.69,34.14 21.69,35.05 21.44,35.31 20.93,35.31 STM32F722.14 | v11.89,40.74 11.33,41.3 11.33,42.72 v10.62,43.43
  Bottom 0.102: v11.89,40.74 v18.59,34.04 | v10.62,43.43 8.69,43.43 7.31,44.81 7.21,44.81 5.99,46.02 5.99,51.16 M1.1
PWM_2  (via drill 0.2)
  Top 0.102: v19.91,34.9 20.88,34.9 STM32F722.15 | v14.33,44.35 10.62,44.35 7.92,47.04 2.44,47.04 1.63,47.85 1.63,51.16 M2.1
  Bottom 0.102: v19.91,34.9 19.46,34.9 14.33,40.03 v14.33,44.35
PWM_3  (via drill 0.2)
  Top 0.102: v26.31,40.84 27.38,40.84 27.63,40.59 27.63,38.41 28.4,37.64 28.4,32.36 STM32F722.28 | v23.52,40.13 23.52,40.49 20.02,43.99 20.02,44.09 17.32,46.79 v15.44,46.79
  Bottom 0.102: v26.31,40.84 25.6,40.13 v23.52,40.13 | M3.1 v15.44,46.79
PWM_4
  Top 0.102: M4.1 26.21,54.61 28.14,52.68 28.14,51.66 31.09,48.72 31.09,39.27 28.96,37.13 28.96,32.36 STM32F722.29
RST  (via drill 0.2, 0.35)
  Top 0.102: v25.65,4.42 25.65,4.22 24.44,3 | 24.44,3 24.38,2.95 RESET.P$1 | v23.57,38.86 20.93,38.86 STM32F722.7 | v47.14,40.28 47.14,39.42 46.79,39.07 v46.79,38.76 | v42.37,38.96 37.49,38.96 | 37.49,38.96 v36.22,38.96 | JTAG.5 46.99,49.53 46.33,48.87 46.33,47.04 39.78,40.49 37.74,40.49 37.49,40.23 37.49,38.96 | v26.8,4.93 26.8,5.31 26.92,5.44 34.34,5.44 38.66,1.12 55.93,1.12 56.08,1.27 56.08,21.79 ICSP.5 53.49,26.52 52.2,26.52 51.54,27.18 51.54,28.47 v50.44,29.57 | C31.2 15.31,11.87 v15.49,11.68 | v22.61,3.05 23.71,3.05 | 24.44,3 24.38,3.05 23.71,3.05 | R13.1 23.71,3.05
  Top 0.203: R13.1 22.61,1.94 v22.61,3.05
  Bottom 0.102: v25.65,4.42 25.78,4.42 26.29,4.93 v26.8,4.93 | v23.57,38.86 24.59,38.86 24.74,39.01 C30.1 24.79,39.07 26.37,39.07 26.62,39.32 33.68,39.32 34.24,38.76 36.02,38.76 v36.22,38.96 | v47.14,40.28 48.36,41.5 48.72,41.5 ATMEGA328P.29 | v42.37,38.96 46.58,38.96 v46.79,38.76 47.24,38.76 49.53,36.47 C35.1 49.53,35.2 50.44,34.29 v50.44,29.57 | v22.61,3.05 22.61,4.57 17.53,9.65 17.53,13.56 18.43,14.46 18.43,16.49 18.34,16.58 16.82,16.58 16.73,16.49 16.73,12.92 v15.49,11.68
SD1_CK  (via drill 0.2)
  Top 0.102: v28.85,41.4 28.45,41.81 28.45,43.84 STM32F722.53 | v38.15,37.13 38.15,34.11 43.76,28.5 45.77,28.5 v48.36,25.91 | v40.39,22.45 39.01,22.45 32.51,15.95 v32.51,14.68 | v28.09,12.34 v30.17,12.34
  Bottom 0.102: v28.85,41.4 37.24,41.4 38.41,40.23 38.41,37.39 v38.15,37.13 | v48.36,25.91 47.19,25.91 46.77,25.49 45.5,25.49 45.21,25.78 41.72,25.78 40.84,24.91 40.84,24.3 40.58,24.03 40.56,24.03 40.39,23.85 v40.39,22.45 | v30.17,12.34 v32.51,14.68 | SD_CARD.5 26.84,11.1 v28.09,12.34
SD1_CMD  (via drill 0.2, 0.35)
  Top 0.102: v24.03,42.57 23.27,42.57 23.01,42.32 23.01,41.91 23.27,41.66 26.21,41.66 27.89,43.33 27.89,43.84 STM32F722.54 | v23.32,35.81 v22.61,36.52 | v24.94,24.44 28.3,21.08 v28.3,14.38 | v23.88,12.95 22.99,12.95 v22.35,12.32
  Bottom 0.102: v24.03,42.57 24.03,41.86 22.61,40.44 v22.61,36.52 | v23.32,35.81 23.32,31.19 25.2,29.31 25.2,24.69 v24.94,24.44 | v28.3,14.38 25.65,14.38 24.23,12.95 v23.88,12.95 | v22.35,12.32 24.64,10.03 SD_CARD.3
SD1_D0  (via drill 0.2)
  Top 0.102: v42.75,28.85 41.99,28.85 33.5,37.34 32.46,37.34 STM32F722.39 | v54.41,20.85 53.9,21.36 52.17,21.36 51.56,21.97 51.56,23.95 46.41,29.11 v46.02,29.11
  Bottom 0.102: v46.02,29.11 45.77,28.85 v42.75,28.85 | v54.41,20.85 54.41,20.73 56.03,19.1 56.03,1.22 55.93,1.12 31.14,1.12 29.04,3.21 SD_CARD.7
SPI1_MISO  (via drill 0.2)
  Top 0.102: v34.54,32 34.54,30.53 37.39,27.69 45.24,27.69 47.3,25.63 47.3,24.94 46.28,23.93 45.16,23.93 MPU6000.9 | v29.31,38.46 29.31,42.47 28.96,42.82 28.96,43.84 STM32F722.52
  Bottom 0.102: v34.54,32 34.54,34.65 30.73,38.46 v29.31,38.46
SPI1_MOSI
  Top 0.102: MPU6000.24 41.2,22.91 36.12,22.91 32.26,26.77 32.26,27.48 31.45,28.3 30.68,28.3 30.38,28.6 30.38,30.02 28.8,31.6 28.19,31.6 27.94,31.85 27.94,32.31 STM32F722.27
SPI1_NSS  (via drill 0.2)
  Top 0.102: v36.02,29.72 37.85,27.89 45.34,27.89 47.5,25.73 47.5,24.84 46.08,23.42 45.16,23.42 MPU6000.8 | v24.44,31.34 24.44,32.31 STM32F722.20
  Bottom 0.102: v36.02,29.72 33.17,29.72 31.09,31.8 24.89,31.8 v24.44,31.34
SPI1_SCLK  (via drill 0.2)
  Top 0.102: v32.31,28.09 32.46,27.94 32.46,26.87 35.92,23.42 41.2,23.42 MPU6000.23 | v26.52,36.63 27.18,37.29 v27.18,40.39 | v29.62,42.82 29.62,43.18 29.46,43.33 29.46,43.84 STM32F722.51
  Bottom 0.102: v32.31,28.09 28.55,28.09 25.76,30.89 24.23,30.89 23.98,31.14 23.98,34.09 v26.52,36.63 | v29.62,42.82 v27.18,40.39
SPI2_MISO  (via drill 0.2)
  Top 0.102: v26.57,37.34 20.93,37.34 STM32F722.10 | v33.53,34.34 33.53,34.04 39.27,28.3 45.54,28.3 47.9,25.93 47.9,24.59 42.52,19.2 40.59,19.2 39.42,18.03 39.42,11.18 38.25,10.01 37.64,10.01 36.68,9.04 36.68,7.47 NRF24L01.MISO
  Bottom 0.102: v26.57,37.34 27.18,37.34 30.17,34.34 v33.53,34.34
SPI2_MOSI  (via drill 0.2)
  Top 0.102: v23.52,37.8 23.47,37.85 STM32F722.9 | v24.23,24.49 24.74,23.98 25.09,23.98 27.84,21.23 27.84,13.31 v28.09,13.06
  Bottom 0.102: v23.52,37.8 23.52,36.68 22.4,35.56 22.4,31.19 24.23,29.36 v24.23,24.49 | v28.09,13.06 28.55,12.6 28.55,11.28 27.94,10.67 27.94,10.26 28.24,9.96 35.05,9.96 35.1,10.01 36.98,10.01 NRF24L01.MOSI
SPI2_NSS
  Top 0.102: NRF24L01.CSN 39.22,12.55 39.22,18.14 40.49,19.41 42.42,19.41 47.7,24.69 47.7,25.83 45.44,28.09 39.12,28.09 32.87,34.34 32.46,34.34 STM32F722.33
SPI2_SCLK  (via drill 0.2)
  Top 0.102: v33.48,35.05 33.33,34.9 32.46,34.9 STM32F722.34 | v33.98,27.94 v33.98,32.51 | v33.43,19.05 v33.43,24.94 | v37.13,15.34 37.13,14.58 36.88,14.33 36.88,10.21 NRF24L01.SCK
  Bottom 0.102: v33.48,35.05 33.98,34.54 v33.98,32.51 | v33.98,27.94 33.98,25.5 v33.43,24.94 | v37.13,15.34 v33.43,19.05
SWCLK  (via drill 0.2)
  Top 0.102: v30.43,44.86 30.43,43.89 STM32F722.49 | v34.65,57.91 35,57.91 35.31,58.22 58.62,58.22 JTAG.2
  Bottom 0.102: v30.43,44.86 31.29,44.86 33.22,46.79 33.22,56.03 34.65,57.46 v34.65,57.91
SWDIO
  Top 0.102: JTAG.4 44.45,52.07 33.27,40.89 32.46,40.89 STM32F722.46
SWO  (via drill 0.2)
  Top 0.102: v27.94,44.86 27.43,44.35 27.43,43.89 STM32F722.55 | v35.1,49.02 41.1,49.02 44.6,52.53 v57.3,52.53
  Bottom 0.102: v27.94,44.86 29.77,44.86 30.23,44.4 31.14,44.4 35.1,48.36 v35.1,49.02 | v57.3,52.53 57.3,50.65 58.78,49.17 58.78,47.9 JTAG.6
TRIGG1_IN
  Bottom 0.102: SONIC1.2 49.33,58.62 50.8,58.62 51.87,57.56 51.87,42.72 49.89,40.74 48.77,40.74 ATMEGA328P.30
TRIGG2_IN
  Bottom 0.102: SONIC2.2 48.26,49.38 46.48,47.6 46.48,46.23 ATMEGA328P.23
UART1_RX  (via drill 0.2)
  Top 0.102: OSD.3 25.2,58.22 33.27,58.22 33.93,57.56 33.93,56.74 33.22,56.03 33.22,52.07 31.34,50.19 31.34,39.93 31.9,39.37 32.41,39.37 STM32F722.43 31.85,39.37 31.39,38.91 v31.39,38.46 | v21.08,15.65 19.25,15.65 FT232RL.1
  Bottom 0.102: v21.08,15.65 21.08,16.23 24.36,19.51 37.59,19.51 37.69,19.41 39.17,19.41 39.37,19.61 39.37,30.53 31.45,38.46 v31.39,38.46
UART1_TX  (via drill 0.2)
  Top 0.102: v33.43,38.86 32.46,38.86 STM32F722.42 | v26.72,38.76 25.86,38.76 22.66,41.96 v22.66,42.62 | v22.45,14.88 22.45,13.61 21.89,13.06 19.25,13.06 FT232RL.5 | v25.09,19.05 25.09,23.32 v24.89,23.52
  Bottom 0.102: v33.43,38.86 31.65,38.86 31.6,38.91 26.87,38.91 v26.72,38.76 26.11,38.15 26.11,37.29 23.77,34.95 23.77,31.04 25.4,29.41 25.4,24.23 24.89,23.72 v24.89,23.52 | v22.66,42.62 22.66,44.91 21.03,46.53 21.03,47.8 24.23,51 24.54,51 25.6,52.07 25.6,56.08 OSD.4 | v22.45,14.88 22.45,15.29 22.05,15.7 22.05,16.89 24.21,19.05 v25.09,19.05
UART2_RX
  Top 0.102: GPS.3 23.01,60.81 2.34,60.81 1.42,59.89 1.42,45.52 2.13,44.81 5.08,44.81 6.35,43.54 6.35,36.78 7.21,35.92 7.31,35.92 10.87,32.36 STM32F722.17
UART2_TX  (via drill 0.2)
  Top 0.102: v19.46,35.56 19.46,34.7 19.76,34.39 20.88,34.39 STM32F722.16
  Bottom 0.102: v19.46,35.56 19.46,43.33 19.1,43.69 19.1,48.11 23.06,52.07 23.06,54.61 25.6,57.15 25.6,58.62 GPS.4
USBDM
  Top 0.102: USB.D- 10.92,4.72 10.92,5.18 12.55,6.81 24.89,6.81 25.91,7.82 26.47,7.82 FT232RL.16
USBDP
  Top 0.102: USB.D+ 11.58,4.72 11.58,5.18 13,6.6 25.91,6.6 26.47,7.16 FT232RL.15
USBOSD  (via drill 0.2)
  Top 0.102: v35.56,42.52 33.43,40.39 32.46,40.39 STM32F722.45
  Bottom 0.102: OSD/USB.2 v35.56,42.52
V_USB  (via drill 0.2)
  Top 0.102: v10.26,3.56 USB.VBUS
  Bottom 0.102: v10.26,3.56 8.03,3.56 6.5,5.08 D1.A
VCC  (via drill 0.25, 0.35)
  Top 0.203: 44.25,26.62 43.43,27.43 33.73,27.43 31.95,29.21 C5.1 31.34,29.26 31.34,29.46 30.43,30.38 30.43,32.31 STM32F722.32 30.53,32.31 v31.04,32.31 | 44.25,26.62 44.4,26.47 44.4,26.11 MPU6000.13 | 44.25,26.62 v44.6,26.98 | 40.95,35.92 41.96,35.92 45.72,39.68 C4.1 45.77,39.78 50.44,44.45 | 40.95,35.92 39.37,35.92 C17.1 | 49.53,38.05 49.53,37.49 49.17,37.13 49.07,37.13 BMP280.8 50.22,37.13 v51.05,36.29 | 49.53,38.05 49.17,38.41 49.07,38.41 BMP280.6 | 53.62,41.38 TXB0104.1 52.98,41.91 50.44,44.45 | 53.62,41.38 53.9,41.1 53.9,38.96 53.8,38.86 52.63,38.86 51.87,38.1 49.58,38.1 49.53,38.05 | 50.44,44.45 48.87,46.02 48.26,46.02 C29.2 | 53.62,41.38 v54.15,41.91 | v40.95,35.87 40.95,35.92 | C19.1 29.57,13.97 v29.57,15.24 29.57,19.05 C20.1 29.46,19.1 29.46,20.68 23.47,26.67 C16.1 22.45,26.62 v20.37,24.54 | v21.95,13.82 21.84,13.72 19.25,13.72 FT232RL.4 19.15,13.66 18.59,13.66 13.97,9.04 | LED6.A 5.74,7.62 7.16,9.04 13.97,9.04 | 33.12,44.86 34.29,46.02 C3.1 | 33.12,44.86 32.46,44.2 32.46,41.86 STM32F722.48 | v31.85,46.13 33.12,44.86 | OSD.1 20.02,57.15 21.13,56.03 31.9,56.03 OSD/USB.1 | v8.94,24.54 9.14,24.74 LM3940-3.3.3 10.01,24.79 10.01,25.4 12.85,28.24 21.54,28.24 22.45,29.16 C7.1 22.55,29.21 23.88,30.53 23.88,32.31 STM32F722.19 23.88,32.41 23.88,33.43 | 23.88,33.43 23.88,33.48 21.54,35.81 20.98,35.81 STM32F722.13 20.88,35.87 19.91,35.87 19.71,36.07 19.2,36.07 17.42,34.29 C6.1 17.37,34.34 17.22,34.34 16,35.56 8.89,35.56 DAC.2 7.62,38 6.6,39.01 6.6,44.2 GIMBAL_Y.2 | 21.18,46.43 20.32,47.3 C2.1 20.27,47.3 6.04,47.3 GIMBAL_X.2 | 21.18,46.43 22.91,44.7 22.91,43.89 STM32F722.64
  Top 0.203: 21.18,46.43 v21.54,46.79 | 23.88,33.43 v24.49,33.43 | 13.97,9.04 15.65,7.37 v15.75,7.37 | v18.8,4.32 20.74,2.37 R13.2 | v24.73,18 23.59,18 C27.1
  Bottom 0.203: C25.2 45.57,27.94 v44.6,26.98 44.55,27.03 43.33,27.03 40.74,29.62 40.74,35.66 v40.95,35.87 | 56.79,48.51 56.79,56.79 JTAG.1 | 56.79,48.51 56.79,47.04 R2.2 56.74,46.99 56.74,44.45 R3.2 56.64,44.4 v54.15,41.91 | NRF24L01.VCC 37.74,13.97 36.52,15.19 29.57,15.19 | 25.02,15.19 22.96,15.19 22.96,14.63 22.1,13.77 v21.95,13.82 25.74,10.02 SD_CARD.4 | 25.02,15.19 29.57,15.19 | v29.57,15.24 29.57,15.19 | GPS.1 OSD.1 | 31.19,46.74 31.09,46.63 29.87,46.63 29.77,46.74 29.77,46.94 27.94,48.77 R5.2 27.89,49.17 25.45,49.17 24.74,49.89 24.38,49.89 | 31.19,46.74 31.19,48.36 30.48,49.07 R4.2 30.53,49.17 30.53,50.85 GY87.7 31.8,52.12 31.8,55.02 33.02,56.24 OSD/USB.1 | v31.85,46.13 31.24,46.74 31.19,46.74 | 8.94,24.49 10.16,24.49 C22.1 10.21,24.49 12.7,24.49 C32.1 12.75,24.54 v20.37,24.54 | 8.94,24.49 7.62,24.49 C33.1 | v8.94,24.54 8.94,24.49 | GIMBAL_Z.2 GIMBAL_Y.2 GIMBAL_X.2 | 24.38,49.89 23.52,49.89 21.54,47.9 v21.54,46.79 | v31.04,32.31 25.6,32.31 v24.49,33.43 | v51.05,36.29 51.05,37.4 C37.2 C38.2 | v15.75,7.37 16.65,6.46 16.65,1.14 18.85,1.14 18.85,4.27 v18.8,4.32 | 24.38,49.89 24.86,50.36 v24.86,50.58 | 56.79,48.51 v57.66,48.51 | v24.73,18 25.02,17.72 25.02,15.19
  pour Top: 0.25,61.72 0.25,0.25 0.51,0 63.75,0 63.75,62.99 0.51,62.99 0.51,61.98
VCC_2  (via drill 0.25)
  Top 0.203: M1.2 M2.2 M3.2 M4.2 | ADC1.2 3.5,35.87 3.5,31.8 5.23,30.07 5.23,24.79 LM3940-3.3.1 5.28,24.74 5.28,20.62 4.98,20.32 LED1.A 4.98,20.27 4.98,17.83 LED2.A 4.98,17.78 6.1,16.66 14.02,16.66 14.83,17.46 16.51,17.46 C18.1 18.19,16.51 18.54,16.15 21.84,16.15 22.61,15.39 24.38,15.39 v25.15,14.63 | 61.67,38.71 58.12,38.71 57.86,38.96 57.86,41.1 TXB0104.14 | 61.67,38.71 61.93,38.96 61.93,40.59 60.96,41.55 C28.2 | ICSP.2 62.18,30.43 62.18,36.88 61.72,37.34 61.72,38.66 61.67,38.71 | v28.45,10.47 26.52,10.47 FT232RL.20
  Bottom 0.203: 2.13,33.32 1.57,33.88 1.57,34.7 2.54,35.66 ADC1.2 1.57,37.8 1.57,55.02 2.54,55.98 M1.2 | 2.13,33.32 2.95,33.32 4.12,34.49 4.12,35.87 ADC2.2 | C34.1 2.54,24.49 5.08,24.49 C23.1 | D1.C 2.44,5.08 2.44,24.33 2.49,24.38 C34.1 | 2.13,33.32 2.08,33.27 2.08,27.58 1.57,27.08 1.57,25.45 2.49,24.54 C34.1 | C13.1 42.88,48.26 42.88,50.8 C14.1 42.88,50.85 42.88,53.34 C15.1 42.93,53.39 42.93,54.36 SONIC2.1 SONIC1.1 45.67,59.74 39.42,59.74 38.51,60.66 37.69,60.66 36.83,59.79 | 36.83,59.79 35.97,60.66 34.59,60.66 | 36.83,59.79 37.08,59.54 37.08,49.53 41.25,45.36 42.06,45.36 42.42,45.72 42.42,46.18 ATMEGA328P.18 | 34.59,60.66 33.98,60.66 LED.1 | ATMEGA328P.4 44.81,37.59 44.81,37.13 44.45,36.78 43.64,36.78 43.28,37.13 43.28,37.59 ATMEGA328P.6 43.23,37.69 43.23,38.05 42.82,38.46 41.25,38.46 40.39,37.59 | 28.8,10.47 31.12,10.47 32.97,10.47 35.31,12.8 38.56,12.8 40.28,14.53 40.28,20.32 C21.1 | 28.8,10.47 v28.45,10.47 | C21.1 40.34,20.37 40.34,21.74 39.88,22.2 39.88,24.74 40.39,25.25 40.39,26.42 40.08,26.72 40.08,29.46 40.39,29.76 40.39,37.59 | ICSP.2 59.69,26.87 60.71,25.86 60.71,24.94 60.15,24.38 59.23,24.38 58.17,25.45 58.17,25.86 57.61,26.42 56.73,26.42 55.59,25.27 PPM.2 54.23,23.88 60.11,23.88 60.71,23.28 60.71,22.44 59.81,21.54 49.1,21.54 47.88,20.32 C21.1 | 34.59,60.66 34.59,59.28 35.76,58.12 35.97,58.12 36.58,57.51 36.58,42.47 39.32,39.73 39.32,38.66 40.39,37.59 | v25.15,14.63 27.79,14.63 28.04,14.88 28.55,14.88 28.8,14.63 28.8,10.47

## Text on the board
Top: SHARKSKY F7 / V 1.0
tNames: ULTRASONIC | MOTORS | GIMBAL | 1 | 1 | 1 | 1 | 1 | ADC & DAC | SHARKSKY F7 V 1.0 / (C) CHARPOAN KONG | 1 | 1
bNames: GND | GND | 3V3 | 5V | SENS | SWCLK | 3V3 | GND | RX | TX | 5V 3V3 | SIG | GND | 5V | TRG | ECHO | GND | SIG | GND | SWDIO | SIG | 3V3 | GND | DRDY | INT | FSYNC | SDA | SCL | GND | 3V3 | VCC | RST | SWO | GND | 5V 3V3 | 1 | 1 | SIG | PPM_IN | MISO | 5V | SCLK | MOSI | 5V | GND | RST | GND | SHARKSKY F7 V 1.0 / (C) CHARPOAN KONG